# Altium schematic sheet APP_1_JTAG_m.SchDoc
size Tabloid; SheetNumber: 14; SheetTotal: 14; Sheet_Name: JTAG; Size: 11x17
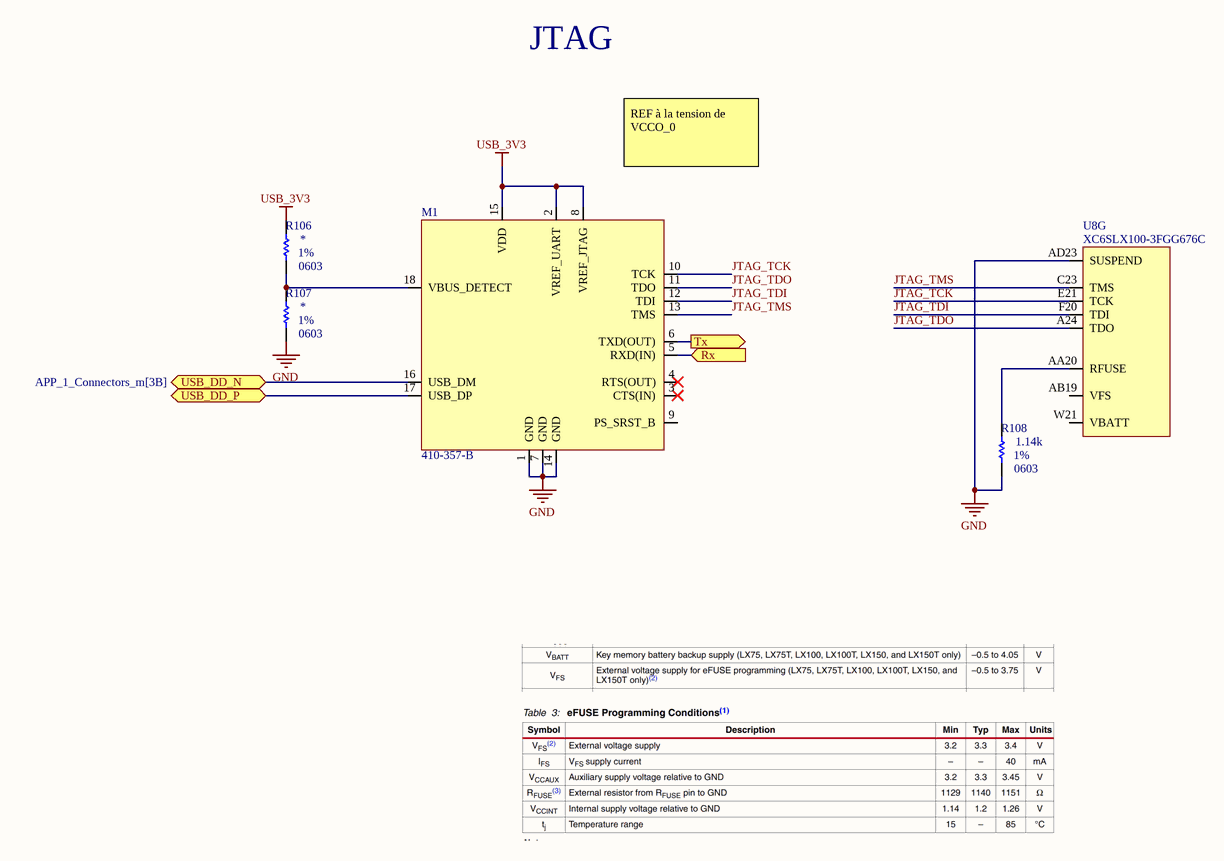
[diagram p0: APP_1_JTAG_m.SchDoc]

## Parts
M1  410-357-B  [MOD_JTAG_410-357-B]
R106  Package: 0603  Precision: 1%  [RES_0603]  (hidden comment: RES - 0603)
R107  Package: 0603  Precision: 1%  [RES_0603]  (hidden comment: RES - 0603)
R108  value 1.14k  Package: 0603  Precision: 1%  [RES_0603]  (hidden comment: RES - 0603)
U8  XC6SLX100-3FGG676C  [FPGA_XILINX_FGG676]  (part G of 10)

## Ports
Rx (in), Tx (out), USB_DD_N (bidir, see APP_1_Connectors_m[3B]), USB_DD_P (bidir, see APP_1_Connectors_m[3B])

## Nets
GND: M1.1(GND) M1.7(GND) M1.14(GND) R107.1 R108.1 U8.AD23(SUSPEND)
USB_3V3: M1.2(VREF_UART) M1.8(VREF_JTAG) M1.15(VDD) R106.2
JTAG_TCK: M1.10(TCK) U8.E21(TCK)
JTAG_TDI: M1.12(TDI) U8.F20(TDI)
JTAG_TDO: M1.11(TDO) U8.A24(TDO)
JTAG_TMS: M1.13(TMS) U8.C23(TMS)
Rx: M1.5(RXD(IN)) ; port Rx
Tx: M1.6(TXD(OUT)) ; port Tx
USB_DD_N: M1.16(USB_DM) ; port USB_DD_N
USB_DD_P: M1.17(USB_DP) ; port USB_DD_P
NetM1_18: M1.18(VBUS_DETECT) R106.1 R107.2
NetR108_2: R108.2 U8.AA20(RFUSE)

Not connected (* = marked no-connect by the designer): M1 3(CTS(IN))* 4(RTS(OUT))* 9(PS_SRST_B); U8 AB19(VFS) W21(VBATT)

## Notes on the sheet
- JTAG
- REF à la tension de VCCO_0
- Sheet Name
- Project Title
- Global Project
- Size
- Group
- Revision
- Date
- Sheet
- of
- Filename
- Designers

## Library data of the parts
M1 = MOD_JTAG_410-357-B: MOD - JTAG-SMT3-NC Programming Module For Xilinx FPGA - 18-SMT; Manufacturer #1: Digilent; Voltage Rating: VDD: 2.97V~3.63V, VJTAG/VUART: 1.65V~5.5V; GRAMS Lib Spec: 2.8; Note: Prior to reflow, the JTAG-SMT3-NC module must be dried at 125°C for 17 hours; Magnetic Material: Unknown; Polarized: Yes; Value: *; Tolerance: *; Current Rating: *; Power Max: *; HelpURL: https://reference.digilentinc.com/_media/reference/programmers/jtag-smt3/jtag-smt3-nc_rm.pdf; CreatedBy/Date: Tommy Rossignol 2018-11-23; VerifiedBy: Nicolas V. (2019-01-28); Temperature: -40°C ~ 85°C; Package: 18-pad SMT; Manufacturer #2: *; Assembly Type: SMD; Part Number #2: *; Part Number #1: 410-357-B; Supplier 1: Digi-Key; Supplier Part Number 1: 1286-1196-ND; Cryo: UNKNOWN
U8 = FPGA_XC6SLX100-3FGG676C: FPGA - XILINX SPARTAN 6 480 I/O - BGA-676; Voltage: 1.14 V ~ 1.26 V; Current: *; Power: *; Mfg: Xilinx; Mfg Part Number: XC6SLX100-3FGG676C; HelpURL: https://www.xilinx.com/support/documentation/data_sheets/ds162.pdf; CreatedBy: Jonathan Bouchard; Temperature: 0°C ~ 85°C (TJ); Value: *; Precision: *; Package: BGA-676; Supplier 1: Digikey; Supplier Part Number 1: 122-1760-ND
R106-R108 = RES - 0603: Current: *; CreatedBy: Jonathan Bouchard
  R106 R107: Value: *